# Altium project modular_prototypes.PrjPcb
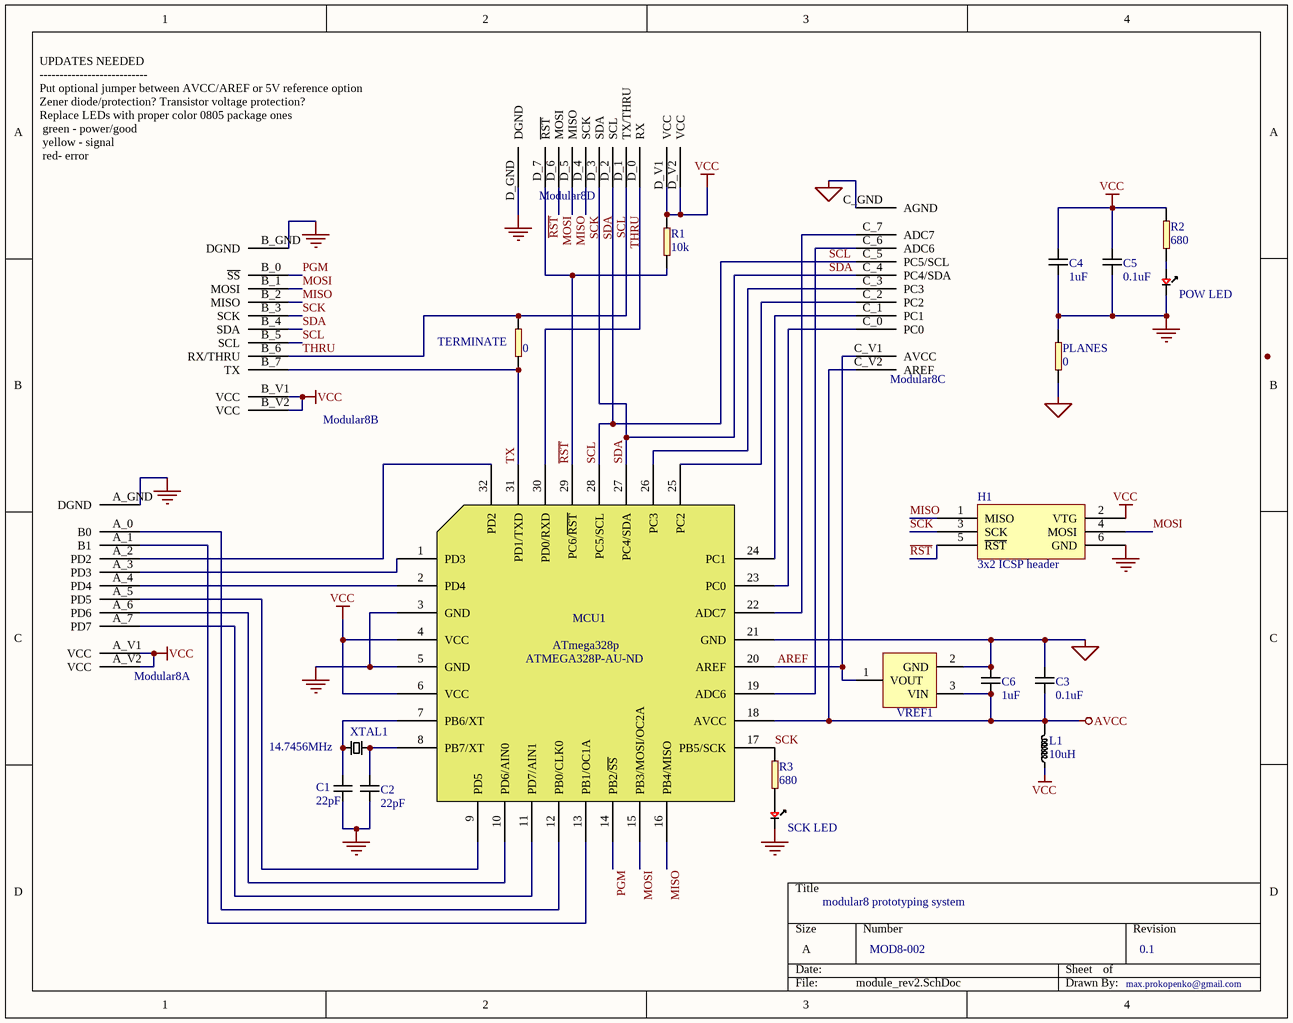
[diagram p0: module_rev2.SchDoc]
1 sheet, 19 parts. Net scope: global (net labels, ports and power ports of the same name join across sheets).
Board file: modular8_master_001.PcbDoc

## Sheet module_rev2.SchDoc
size A

### Parts
C1  C: 22pF  [0603]  (hidden comment: C 22pF 25V)
C2  C: 22pF  [0603]  (hidden comment: C 22pF 25V)
C3  C: 0.1uF  [0603]  (hidden comment: C 0.1uF 25V)
C4  C: 1uF  [0603]  (hidden comment: C 1uF 25V)
C5  C: 0.1uF  [0603]  (hidden comment: C 0.1uF 25V)
C6  C: 1uF  [0603]  (hidden comment: C 1uF 25V)
H1  3x2 ICSP header  [3x2 THRU HOLES 0.1" PITCH]
L1  L: 10uH  [0603]  (hidden comment: L 10uH)
MCU1  ATmega328p  Supplier Part Number 1: ATMEGA328P-AU-ND  [ATmega328p TQFP]
Modular8  modular8_rev2  [modular8 metric]  (value not drawn)  (parts A,B,C,D of 4)
PLANES  R: 0  [0603]  (hidden comment: R 0)
POW_LED  LEDG  [0805 - LED]  (value not drawn)
R1  R: 10k  [0603]  (hidden comment: R 10k)
R2  R: 680  [0603]  (hidden comment: R 680)
R3  R: 680  [0603]  (hidden comment: R 680)
SCK_LED  LEDY  [0805 - LED]  (value not drawn)
TERMINATE  R: 0  [0603]  (hidden comment: R 0)
VREF1  AD1584BRTZ  [SOT-23-3]  (value not drawn)
XTAL1  Frequency: 14.7456MHz  [XTAL CSM-3X]  (hidden comment: XTAL 14.7456MHz)

### Nets
AGND: C3.1 C6.1 MCU1.21(GND) Modular8.C_GND(AGND) PLANES.1 VREF1.2(GND)
AVCC: C3.2 C6.2 L1.1 MCU1.18(AVCC) Modular8.C_V2(AREF) VREF1.3(VIN)
DGND: C1.1 C2.2 C4.2 C5.2 H1.6(GND) MCU1.3(GND) MCU1.5(GND) Modular8.A_GND(DGND) Modular8.B_GND(DGND) Modular8.D_GND(DGND) PLANES.2 POW_LED.2(K) SCK_LED.1(K)
VCC: C4.1 C5.1 H1.2(VTG) L1.2 MCU1.4(VCC) MCU1.6(VCC) Modular8.A_V1(VCC) Modular8.A_V2(VCC) Modular8.B_V1(VCC) Modular8.B_V2(VCC) Modular8.D_V1(VCC) Modular8.D_V2(VCC) R1.1 R2.1
AREF: MCU1.20(AREF) Modular8.C_V1(AVCC) VREF1.1(VOUT)
MISO: H1.1(MISO) MCU1.16(PB4/MISO) Modular8.B_2(MISO) Modular8.D_5(MISO)
MOSI: H1.4(MOSI) MCU1.15(PB3/MOSI/OC2A) Modular8.B_1(MOSI) Modular8.D_6(MOSI)
PGM: MCU1.14(PB2/~{SS}) Modular8.B_0(~{SS})
~{RST}: H1.5(~{RST}) MCU1.29(PC6/~{RST}) Modular8.D_7(~{RST}) R1.2
SCK: H1.3(SCK) MCU1.17(PB5/SCK) Modular8.B_3(SCK) Modular8.D_4(SCK) R3.1
SCL: MCU1.28(PC5/SCL) Modular8.B_5(SCL) Modular8.C_5(PC5/SCL) Modular8.D_2(SCL)
SDA: MCU1.27(PC4/SDA) Modular8.B_4(SDA) Modular8.C_4(PC4/SDA) Modular8.D_3(SDA)
THRU: Modular8.B_6(RX/THRU) Modular8.D_1(TX/THRU) TERMINATE.1
TX: MCU1.31(PD1/TXD) Modular8.B_7(TX) TERMINATE.2
NetC1_2: C1.2 MCU1.7(PB6/XT) XTAL1.1
NetC2_1: C2.1 MCU1.8(PB7/XT) XTAL1.2
NetMCU1_1: MCU1.1(PD3) Modular8.A_3(PD3)
NetMCU1_2: MCU1.2(PD4) Modular8.A_4(PD4)
NetMCU1_9: MCU1.9(PD5) Modular8.A_5(PD5)
NetMCU1_10: MCU1.10(PD6/AIN0) Modular8.A_6(PD6)
NetMCU1_11: MCU1.11(PD7/AIN1) Modular8.A_7(PD7)
NetMCU1_12: MCU1.12(PB0/CLK0) Modular8.A_0(B0)
NetMCU1_13: MCU1.13(PB1/OC1A) Modular8.A_1(B1)
NetMCU1_19: MCU1.19(ADC6) Modular8.C_6(ADC6)
NetMCU1_22: MCU1.22(ADC7) Modular8.C_7(ADC7)
NetMCU1_23: MCU1.23(PC0) Modular8.C_0(PC0)
NetMCU1_24: MCU1.24(PC1) Modular8.C_1(PC1)
NetMCU1_25: MCU1.25(PC2) Modular8.C_2(PC2)
NetMCU1_26: MCU1.26(PC3) Modular8.C_3(PC3)
NetMCU1_30: MCU1.30(PD0/RXD) Modular8.D_0(RX)
NetMCU1_32: MCU1.32(PD2) Modular8.A_2(PD2)
NetPOW_LED_1: POW_LED.1(A) R2.2
NetR3_2: R3.2 SCK_LED.2(A)

### Notes on the sheet
- (near Modular8) UPDATES NEEDED
  ---------------------------
  Put optional jumper between AVCC/AREF or 5V reference option
  Zener diode/protection? Transistor voltage protection?
  Replace LEDs with proper color 0805 package ones
  green - power/good
  yellow - signal
  red- error
- modular8 prototyping system
- MOD8-002
- 0.1
- max.prokopenko@gmail.com

### Library data of the parts
VREF1 = AD1584BRTZ: V: 4.096V; Supplier 1: Digi-Key; Supplier Part Number 1: AD1584BRTZ-REEL7CT-ND
C1 C2 = C 22pF 25V: Supplier 1: Digi-Key; Supplier Part Number 1: 445-1273-1-ND
C3 C5 = C 0.1uF 25V: Supplier 1: Digi-Key; Supplier Part Number 1: 445-1316-1-ND
C4 C6 = C 1uF 25V: Supplier 1: Digi-Key; Supplier Part Number 1: 1276-1858-1-ND
H1 = 3x2 ICSP header: Supplier 1: Digi-Key; Supplier Part Number 1: 609-3234-ND
L1 = L 10uH: Supplier 1: Digi-Key; Supplier Part Number 1: 490-4025-1-ND
MCU1 = ATmega328p: Supplier 1: Digi-Key
PLANES TERMINATE = R 0: Supplier 1: Digi-Key; Supplier Part Number 1: RHM0.0GCT-ND
POW_LED = LEDG: Supplier 1: Digi-Key; Supplier Part Number 1: 160-1423-1-ND
R1 = R 10k: Supplier 1: Digi-Key; Supplier Part Number 1: 311-10KGRCT-ND
R2 R3 = R 680: Supplier 1: Digi-Key; Supplier Part Number 1: 311-680GRCT-ND
SCK_LED = LEDY: Supplier 1: Digi-Key; Supplier Part Number 1: 160-1413-1-ND
XTAL1 = XTAL 14.7456MHz: Supplier 1: Digi-Key; Supplier Part Number 1: XC1775CT-ND